# EAGLE design BottleNosePrototype_Rev3_ShawnS (EAGLE 6.2)
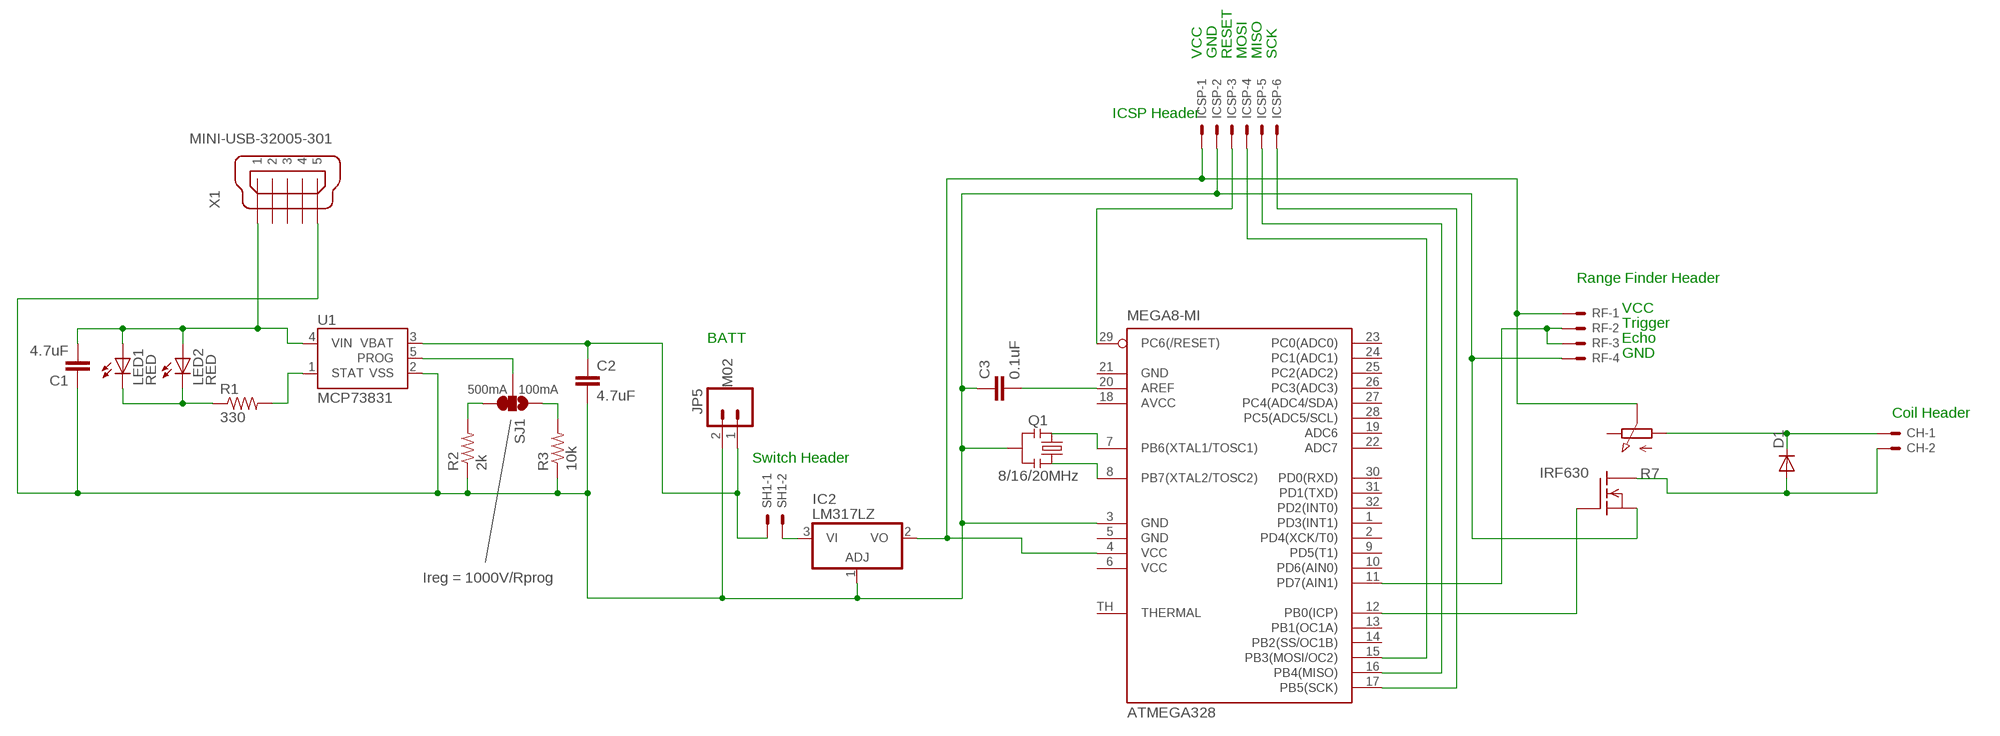
[diagram p0: schematic, sheet 1]

## Parts
ATMEGA328  MEGA8-MI  [MLF32-TH]
C1  4.7uF  CAP0402-CAP  [0402-CAP]
C2  4.7uF  CAP0402-CAP  [0402-CAP]
C3  0.1uF  CAP0402-CAP  [0402-CAP]
CH  22-23-2021  [22-23-2021]
D1  DIODE-MICROMELF-R  [MICROMELF-R]
IC2  LM317LZ  [TO92]
ICSP  22-23-2061  [22-23-2061]
IRF630  IRF620  [TO220]
JP5  M02  M02PTH  [1X02]
LED1  RED  LED0603  [LED-0603]
LED2  RED  LED0603  [LED-0603]
Q1  8/16/20MHz  RESONATORSMD  [RESONATOR-SMD]
R1  330  RESISTOR0402-RES  [0402-RES]
R2  2k  RESISTOR0402-RES  [0402-RES]
R3  10k  RESISTOR0402-RES  [0402-RES]
R7  PC25  [PC25]
RF  22-23-2041  [22-23-2041]
SH1  22-23-2021  [22-23-2021]
SJ1  SOLDERJUMPER_2WAYS  [SJ_3]
U1  MCP73831  [SOT23-5]
X1  MINI-USB-32005-301  [32005-301]

## Nets
AREF: ATMEGA328.20(AREF) C3.2
N$1: ATMEGA328.12(PB0(ICP)) IRF630.1(G)
N$2: R1.2 U1.1(STAT)
N$3: LED1.C LED2.C R1.1
N$4: R2.2 SJ1.3
N$5: IC2.3(VI) SH1.2
N$6: CH.2 D1.A IRF630.2(D)
N$7: R3.2 SJ1.1
N$8: ATMEGA328.7(PB6(XTAL1/TOSC1)) Q1.3
N$9: ATMEGA328.8(PB7(XTAL2/TOSC2)) Q1.1
N$10: CH.1 D1.C R7.A
N$12: ATMEGA328.15(PB3(MOSI/OC2)) ICSP.4
N$13: ATMEGA328.17(PB5(SCK)) ICSP.6
N$15: ATMEGA328.16(PB4(MISO)) ICSP.5
N$16: ATMEGA328.29(PC6(/RESET)) ICSP.3
N$20: C1.2 LED1.A LED2.A U1.4(VIN) X1.1
N$22: C2.1 JP5.1 SH1.1 U1.3(VBAT)
N$31: ATMEGA328.3(GND) C1.1 C2.2 C3.1 IC2.1(ADJ) ICSP.2 IRF630.3(S) JP5.2 Q1.2 R2.1 R3.1 RF.4 U1.2(VSS) X1.5
N$35: ATMEGA328.4(VCC) IC2.2(VO) ICSP.1 R7.S RF.1
N$36: ATMEGA328.11(PD7(AIN1)) RF.2 RF.3
PROG: SJ1.2 U1.5(PROG)
Unconnected: ATMEGA328.1(PD3(INT1)) ATMEGA328.2(PD4(XCK/T0)) ATMEGA328.9(PD5(T1)) ATMEGA328.10(PD6(AIN0)) ATMEGA328.13(PB1(OC1A)) ATMEGA328.14(PB2(SS/OC1B)) ATMEGA328.19(ADC6) ATMEGA328.22(ADC7) ATMEGA328.23(PC0(ADC0)) ATMEGA328.24(PC1(ADC1)) ATMEGA328.25(PC2(ADC2)) ATMEGA328.26(PC3(ADC3)) ATMEGA328.27(PC4(ADC4/SDA)) ATMEGA328.28(PC5(ADC5/SCL)) ATMEGA328.30(PD0(RXD)) ATMEGA328.31(PD1(TXD)) ATMEGA328.32(PD2(INT0)) ATMEGA328.TH(THERMAL) R7.E X1.2 X1.3 X1.4

## Notes on the sheet
- VCC | GND | RESET | MOSI | MISO | SCK
- ICSP Header
- Range Finder Header
- VCC
- Trigger
- BATT | Echo
- GND
- 500mA | 100mA
- Coil Header
- Switch Header
- Ireg = 1000V/Rprog

## Power pins joined to a net without a drawn wire
AVCC: ATMEGA328.18(AVCC)
GND: ATMEGA328.5(GND) ATMEGA328.21(GND)
VCC: ATMEGA328.6(VCC)

## Library data of the parts
ATMEGA328 = atmel:MEGA8-MI: MICROCONTROLLER 8 Kbytes FLASH, 1 kbytes SRAM, 512 bytes EEPROM, USART, 6-channel 10 bit ADC, 2-channel 8 bit ADC Pin compatible with Atmega48, ATMega88, ATMega168 Source: avr.lbr; MPN: ATMEGA88PA-MU; OC_FARNELL: 1715491; OC_NEWARK: 15R0272
C1-C3 = SparkFun:CAP: Capacitor Standard 0603 ceramic capacitor, and 0.1" leaded capacitor.
CH SH1 = con-molex:22-23-2021: .100" (2.54mm) Center Header - 2 Pin; MF: MOLEX; MPN: 22-23-2021; OC_FARNELL: 1462926; OC_NEWARK: 25C3832
D1 = diode:DIODE-: DIODE
IC2 = linear:*317: Positive VOLTAGE REGULATOR
ICSP = con-molex:22-23-2061: .100" (2.54mm) Center Header - 6 Pin; MF: MOLEX; MPN: 22-23-2061; OC_FARNELL: 1462922; OC_NEWARK: 27C1933
IRF630 = transistor-fet:IRF620: N-Channel Enhancement MOSFET (HEXFET); 200V; 5,2A; 0,8Ohm
JP5 = SparkFun:M02: Header 2 Standard 2-pin 0.1" header. Use with straight break away headers (SKU : PRT-00116), right angle break away headers (PRT-00553), swiss pins (PRT-00743), machine pins (PRT-00117), and female headers (PRT-00115). Molex polarized connector foot print use with SKU : PRT-08233 with associated crimp pins and housings.
LED1 LED2 = SparkFun:LED: LEDs Standard schematic elements and footprints for 5mm, 3mm, 1206, and 0603 sized LEDs. 5mm - Spark Fun Electronics SKU : COM-00529 (and others)
Q1 = SparkFun:RESONATOR: Resonator Small SMD resonator. This is the itty bitty 10/20MHz resonators with built in caps. CSTCE10M0G55 and CSTCE20M0V53. Footprint has been reviewed closely but hasn't been tested yet.
R1-R3 = SparkFun:RESISTOR: Resistor Basic schematic elements and footprints for 0603, 1206, and PTH resistors.
R7 = pot-vitrohm:PC25: VITROHM POTENTIOMETER; MF: CLAROSTAT; MPN: 308NPC25KS; OC_FARNELL: 1440998; OC_NEWARK: 03F7518
RF = con-molex:22-23-2041: .100" (2.54mm) Center Header - 4 Pin; MF: MOLEX; MPN: 22-23-2041; OC_FARNELL: 1462920; OC_NEWARK: 38C0355
SJ1 = SparkFun:SOLDERJUMPER_2WAY: Solder Jumper 2 way solder jumper
U1 = SparkFun:MCP73831: Microchip's MCP73831 Miniature single cell, fully integrated Li-Ion, Li-polymer charge management controller http://ww1.microchip.com/downloads/en/DeviceDoc/21984a.pdf
X1 = con-cypressindustries:MINI-USB-: MINI USB-B Conector Source: www.cypressindustries.com; OC_FARNELL: unknown; OC_NEWARK: unknown

## Net classes
0 default: width 0.203 mm
1 power: width 0.254 mm

## Board
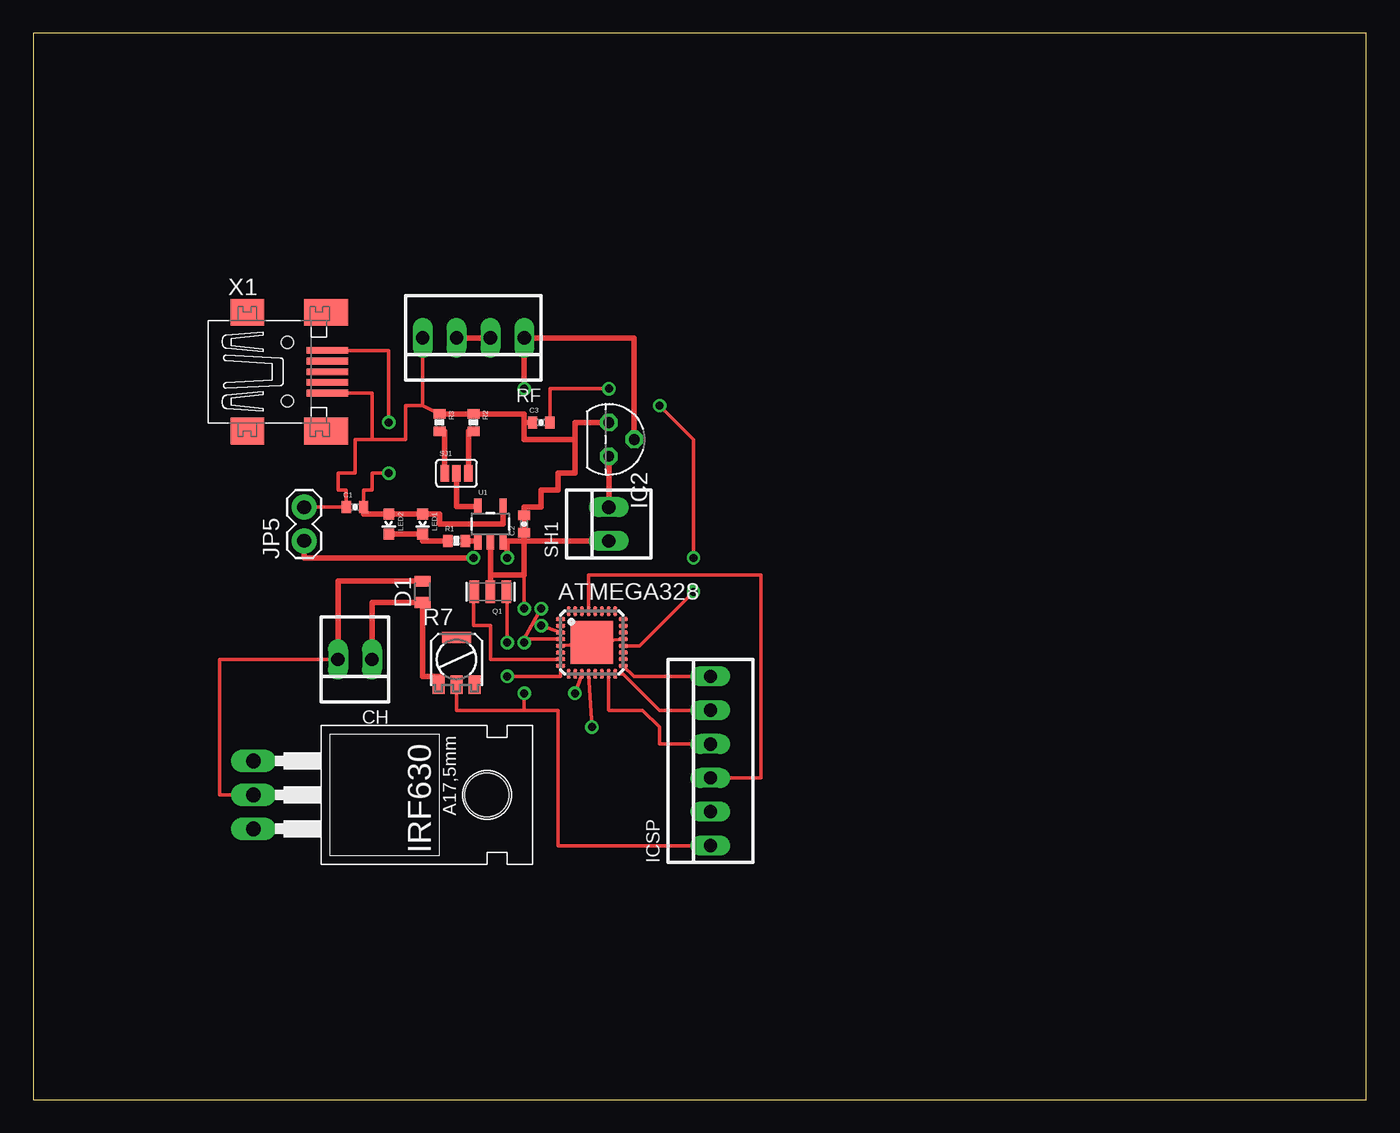
[diagram p1: board, top side]
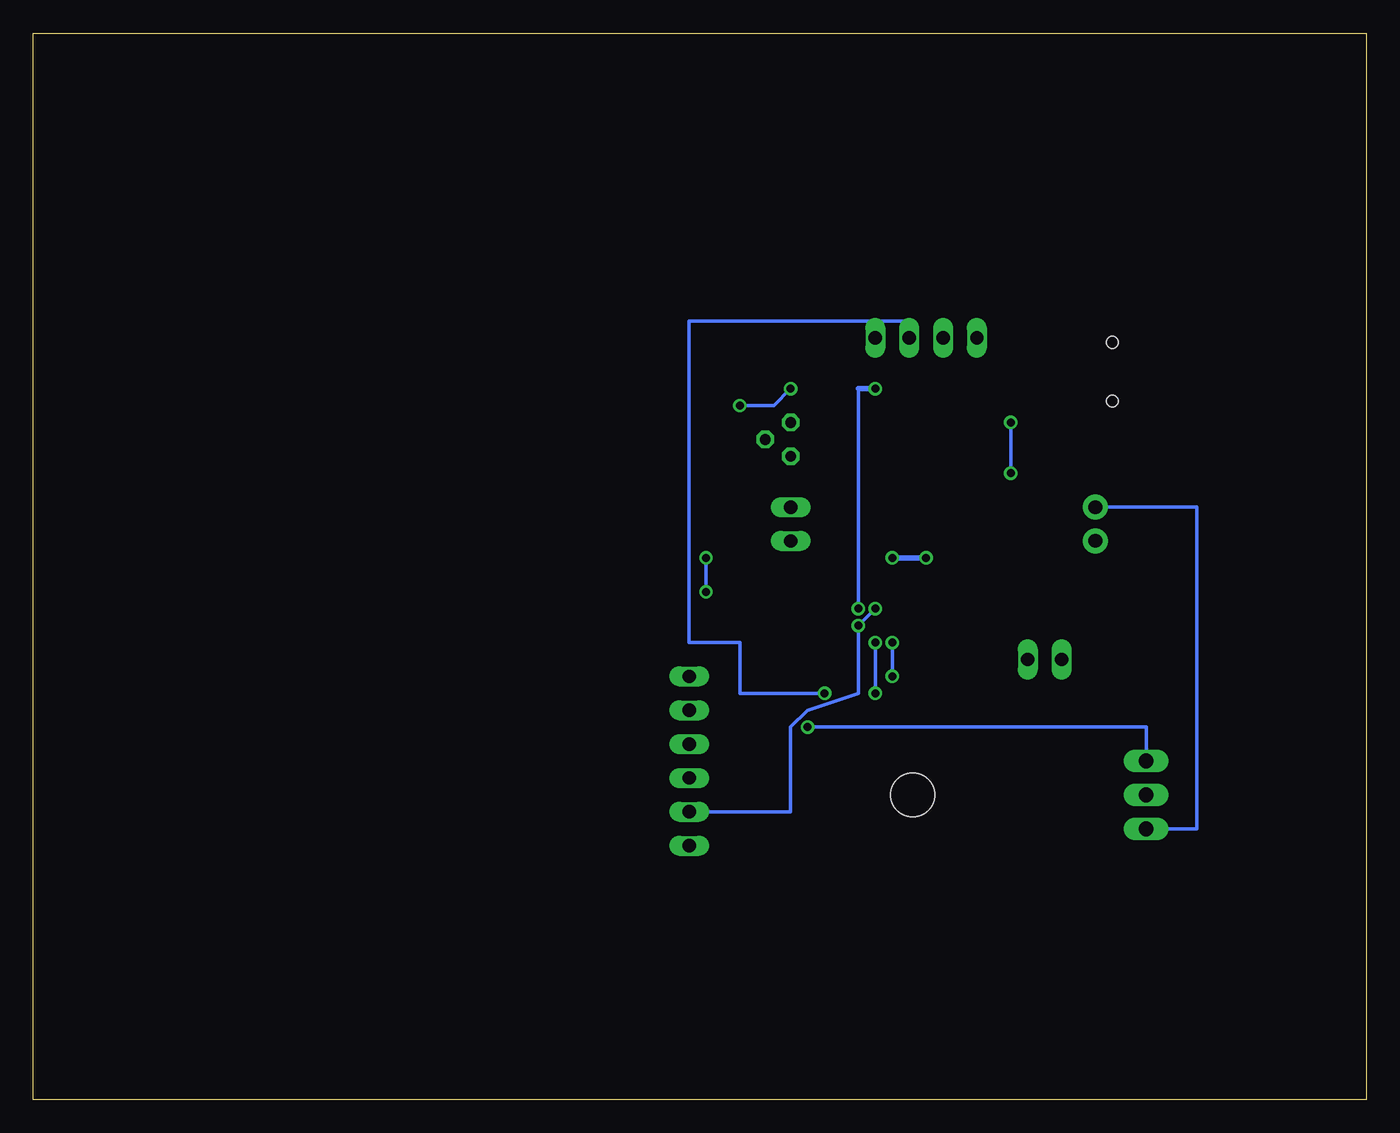
[diagram p2: board, bottom side, seen from below]

Size 100 x 80 mm. Coordinates in mm from the lower left corner, seen from the top.
Outline: 0,0 100,0 100,80 0,80 0,0
Copper layers (1*16): Top 0.035mm / dielectric 1.5mm / Bottom 0.035mm
Design rules: minimum track width 10mil, minimum drill 24mil, track to track 8mil, track to pad 8mil, pad to pad 8mil, via to via 8mil, smd to smd 8mil, copper to edge 40mil, drill to drill 8mil, minimum pad ring 10mil, minimum via ring 8mil, stop-mask expansion 4mil, vias tented up to drill 0mil, thermal gap 10mil

### Footprints (pad centres in the part's own frame; a part is rotated, then mirrored left to right if it is on the bottom)
MLF32-TH = smd 0.7 x 0.3: 1 -2.35,1.75; 2 -2.35,1.25; 3 -2.35,0.75; 4 -2.35,0.25; 5 -2.35,-0.25; 6 -2.35,-0.75; 7 -2.35,-1.25; 8 -2.35,-1.75; 17 2.35,-1.75; 18 2.35,-1.25; 19 2.35,-0.75; 20 2.35,-0.25; 21 2.35,0.25; 22 2.35,0.75; 23 2.35,1.25; 24 2.35,1.75 | smd 0.3 x 0.7: 9 -1.75,-2.35; 10 -1.25,-2.35; 11 -0.75,-2.35; 12 -0.25,-2.35; 13 0.25,-2.35; 14 0.75,-2.35; 15 1.25,-2.35; 16 1.75,-2.35; 25 1.75,2.35; 26 1.25,2.35; 27 0.75,2.35; 28 0.25,2.35; 29 -0.25,2.35; 30 -0.75,2.35; 31 -1.25,2.35; 32 -1.75,2.35 | smd 3.2 x 3.2: TH 0,0
0402-CAP = smd 0.7 x 0.9: 1 -0.65,0; 2 0.65,0
22-23-2021 = drill 1 long: 1 -1.27,0; 2 1.27,0
MICROMELF-R = smd 0.8 x 1.2: A 0.8,0; C -0.8,0
TO92 = drill 0.813 octagon: 1 -1.27,0; 2 0,1.905; 3 1.27,0
22-23-2061 = drill 1 long: 1 -6.35,0; 2 -3.81,0; 3 -1.27,0; 4 1.27,0; 5 3.81,0; 6 6.35,0
TO220 = drill 1.118 long: 1 -2.54,-6.35; 2 0,-6.35; 3 2.54,-6.35 | hole 3.302: 0,11.176
1X02 = drill 1.016 pad 1.88: 1 0,0; 2 2.54,0
LED-0603 = smd 0.8 x 0.8: A 0,-0.75; C 0,0.75
RESONATOR-SMD = smd 0.7 x 1.7: 1 -1.2,0; 2 0,0; 3 1.2,0
0402-RES = smd 0.7 x 0.9: 1 -0.65,0; 2 0.65,0
PC25 = smd 2.2 x 0.8: 4 0,1.65 | smd 0.9 x 1.4: A -1.35,-1.9; E 1.35,-1.9; S 0,-1.9
22-23-2041 = drill 1 long: 1 -3.81,0; 2 -1.27,0; 3 1.27,0; 4 3.81,0
SJ_3 = smd 0.635 x 1.27: 1 -0.889,0; 2 0,0; 3 0.889,0
SOT23-5 = smd 0.55 x 1.2: 1 -0.95,-1.3; 2 0,-1.3; 3 0.95,-1.3; 4 0.95,1.3; 5 -0.95,1.3
32005-301 = smd 3.1 x 0.5: 1 3,1.6; 2 3,0.8; 3 3,0; 4 3,-0.8; 5 3,-1.6 | smd 2.5 x 2: M1 -3,-4.45; M2 -3,4.45 | smd 3.3 x 2: M3 2.9,4.45; M4 2.9,-4.45 | hole 0.9: 0,2.2; 0,-2.2

### Placement (x,y rotation side)
ATMEGA328  41.91,34.29 0 top
C1  24.13,44.45 0 top
C2  36.83,43.18 90 top
C3  38.1,50.8 0 top
CH  24.13,33.02 180 top
D1  29.21,38.1 90 top
IC2  43.18,49.53 270 top
ICSP  50.8,25.4 90 top
IRF630  22.86,22.86 270 top
JP5  20.32,41.91 90 top
LED1  29.21,43.18 180 top
LED2  26.67,43.18 180 top
Q1  34.29,38.1 180 top
R1  31.75,41.91 0 top
R2  33.02,50.8 270 top
R3  30.48,50.8 270 top
R7  31.75,33.02 0 top
RF  33.02,57.15 180 top
SH1  43.18,43.18 90 top
SJ1  31.75,46.99 0 top
U1  34.29,43.18 0 top
X1  19.05,54.61 0 top

### Tracks (layer width: path | path; a pad name or v marks a point on that pad's centre or on a via)
AREF  (via drill 0.6)
  Top 0.254: ATMEGA328.20 45.47,34.04 v49.53,38.1 | v49.53,40.64 49.53,49.53 v46.99,52.07 | v43.18,53.34 38.75,53.34 C3.2
  Bottom 0.254: v49.53,38.1 v49.53,40.64 | v46.99,52.07 44.45,52.07 v43.18,53.34
GND
  Top 0.254: ATMEGA328.21 ATMEGA328.5
N$1  (via drill 0.6)
  Top 0.254: v41.91,27.94 ATMEGA328.12
  Bottom 0.254: IRF630.1 16.51,27.94 v41.91,27.94
N$2
  Top 0.406: R1.2 33.34,41.91 U1.1
N$3
  Top 0.406: R1.1 29.21,41.91 LED1.C LED2.C
N$4
  Top 0.406: R2.2 32.64,50.15 SJ1.3
N$5
  Top 0.406: SH1.2 IC2.3
N$6
  Top 0.254: CH.2 13.97,33.02 13.97,22.86 IRF630.2
  Top 0.406: D1.A 22.86,38.9 CH.2
N$7
  Top 0.406: R3.2 30.86,50.15 SJ1.1
N$8
  Top 0.254: Q1.3 33.02,38.1 33.02,35.56 34.29,35.56 34.29,33.02 39.56,33.02 ATMEGA328.7
N$9  (via drill 0.6)
  Top 0.254: Q1.1 35.56,38.1 v35.56,34.29 | v35.56,31.75 39.56,31.75 ATMEGA328.8
  Bottom 0.254: v35.56,34.29 v35.56,31.75
N$10
  Top 0.406: CH.1 25.4,37.3 D1.C 29.21,31.75 30.4,31.75 | 30.48,31.75 30.4,31.75 | 30.4,31.75 R7.A
N$12
  Top 0.254: ATMEGA328.15 43.16,29.23 43.18,29.21 45.72,29.21 46.99,27.94 46.99,26.67 ICSP.4
N$13
  Top 0.254: ICSP.6 45.05,31.75 ATMEGA328.17
N$15
  Top 0.254: ATMEGA328.16 44.26,31.94 46.99,29.21 ICSP.5
N$16
  Top 0.254: ICSP.3 54.61,24.13 54.61,39.37 41.66,39.37 ATMEGA328.29
N$20  (via drill 0.6)
  Top 0.254: X1.1 26.67,56.21 v26.67,50.8 | v26.67,46.99 25.4,46.99 25.4,45.72 24.78,45.72 C1.2
  Top 0.406: U1.4 35.24,43.18 30.48,43.18 30.48,43.93 LED1.A LED2.A 24.78,43.93 C1.2
  Bottom 0.254: v26.67,50.8 v26.67,46.99
N$21  (via drill 0.6)
  other vias: 26.67,46.99
N$22  (via drill 0.6)
  Top 0.406: 36.83,41.91 35.56,41.91 | 35.56,41.91 35.24,41.91 U1.3 | C2.1 36.83,41.91 | 36.83,41.91 SH1.1 | 35.56,41.91 v35.56,40.64 | v33.02,40.64 20.32,40.64 JP5.1
  Bottom 0.406: v33.02,40.64 v35.56,40.64
N$23  (via drill 0.6)
  other vias: 26.67,50.8
N$24  (via drill 0.6)
  other vias: 35.56,34.29
N$25  (via drill 0.6)
  other vias: 35.56,31.75
N$26  (via drill 0.6)
  other vias: 36.83,34.29
N$28  (via drill 0.6)
  other vias: 36.83,30.48
N$29  (via drill 0.6)
  other vias: 49.53,40.64
N$30  (via drill 0.6)
  other vias: 43.18,53.34
N$31  (via drill 0.6)
  Top 0.254: RF.4 29.21,52.07 | 29.21,52.07 R3.1 | X1.5 25.4,53.01 25.4,49.53 | 25.4,49.53 27.94,49.53 27.94,52.07 29.21,52.07 | 25.4,49.53 24.13,49.53 24.13,46.99 22.86,46.99 22.86,45.72 23.48,45.72 C1.1 JP5.2 | 36.83,39.37 v36.83,36.83 | v38.1,35.56 ATMEGA328.3
  Top 0.406: R3.1 R2.1 36.83,51.45 36.83,50.8 | U1.2 34.29,39.37 | 34.29,39.37 Q1.2 | IC2.1 40.64,50.8 40.64,49.53 | 40.64,49.53 40.64,46.99 39.37,46.99 39.37,45.72 38.1,45.72 38.1,44.45 36.83,44.45 C2.2 36.83,39.37 34.29,39.37 | C3.1 36.83,50.8 | 36.83,50.8 36.83,49.53 40.64,49.53
  Bottom 0.254: IRF630.3 12.7,20.32 12.7,44.45 JP5.2 | v36.83,36.83 v38.1,35.56 38.1,30.48 41.91,29.21 43.18,27.94 43.18,21.59 ICSP.2
N$32  (via drill 0.6)
  other vias: 36.83,36.83
N$33  (via drill 0.6)
  other vias: 38.1,35.56
N$35  (via drill 0.6)
  Top 0.254: ATMEGA328.4 36.83,34.54 | 36.83,34.54 v38.1,36.83 | 36.83,34.54 v36.83,34.29 | v36.83,30.48 36.83,29.21 | 36.83,29.21 31.75,29.21 R7.S | ICSP.1 39.37,19.05 39.37,29.21 36.83,29.21
  Top 0.406: IC2.2 45.09,57.15 RF.1 v36.83,53.34
  Bottom 0.254: 38.1,53.34 v38.1,36.83 | v36.83,34.29 v36.83,30.48
  Bottom 0.406: v36.83,53.34 38.1,53.34
N$36  (via drill 0.6)
  Top 0.254: ATMEGA328.11 v40.64,30.48
  Top 0.406: RF.3 RF.2
  Bottom 0.254: v40.64,30.48 46.99,30.48 46.99,34.29 50.8,34.29 50.8,58.42 34.29,58.42 RF.2
N$39  (via drill 0.6)
  other vias: 40.64,30.48
PROG
  Top 0.406: U1.5 31.75,44.48 SJ1.2